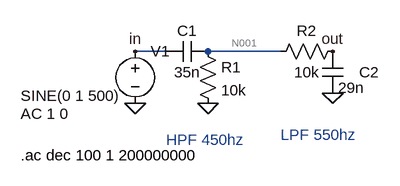
[diagram p0: schematic PassiveBandpassFilter.asc]
PassiveBandpassFilter.asc, the LTspice schematic file:
Version 4
SHEET 1 880 680
WIRE 144 96 96 96
WIRE 320 96 208 96
FLAG 208 176 0
FLAG 400 160 0
FLAG 96 176 0
FLAG 400 96 out
FLAG 96 96 in
SYMBOL cap 208 80 R90
WINDOW 0 0 32 VBottom 2
WINDOW 3 32 32 VTop 2
SYMATTR InstName C1
SYMATTR Value 35n
SYMBOL res 192 80 R0
SYMATTR InstName R1
SYMATTR Value 10k
SYMBOL res 416 80 R90
WINDOW 0 0 56 VBottom 2
WINDOW 3 32 56 VTop 2
SYMATTR InstName R2
SYMATTR Value 10k
SYMBOL cap 384 96 R0
WINDOW 0 57 32 Left 2
SYMATTR InstName C2
SYMATTR Value 29n
SYMBOL voltage 96 80 R0
WINDOW 3 -176 84 Left 2
WINDOW 123 -176 112 Left 2
WINDOW 39 0 0 Left 0
SYMATTR Value SINE(0 1 500)
SYMATTR Value2 AC 1 0
SYMATTR InstName V1
TEXT 144 232 Left 2 ;HPF 450hz
TEXT 320 224 Left 2 ;LPF 550hz
TEXT -80 256 Left 2 !.ac dec 100 1 200000000

The netlist it stands for:
* PassiveBandpassFilter.asc
C1 N001 in 35n
R1 N001 0 10k
R2 out N001 10k
C2 out 0 29n
V1 in 0 SINE(0 1 500) AC 1 0
* HPF 450hz
* LPF 550hz
.ac dec 100 1 200000000
.backanno
.end

* Results of the author's LTspice run, read from the files saved beside the schematic
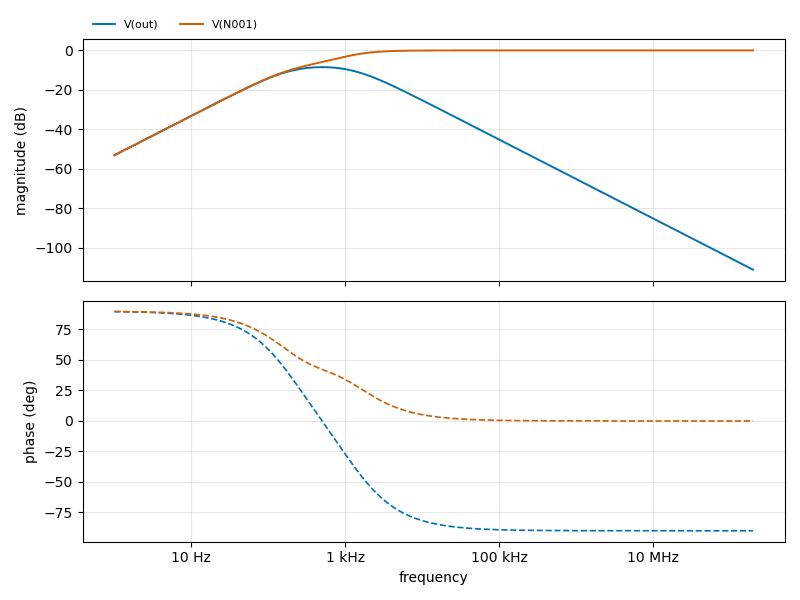
[diagram p1: AC Analysis of PassiveBandpassFilter.asc, plotted from the saved traces]
* AC Analysis, 1 run:
*   V(out): -53.16 dB at 1 Hz, -111.23 dB at 200 MHz, peak -8.49 dB at 501.2 Hz, 3 dB below the peak at 154.7 Hz and 1.613 kHz
*   V(N001): -53.16 dB at 1 Hz, -0.00 dB at 200 MHz, peak -0.00 dB at 200 MHz, 3 dB below the peak at 1.04 kHz